# EAGLE design LightBar (EAGLE 7.3.0)
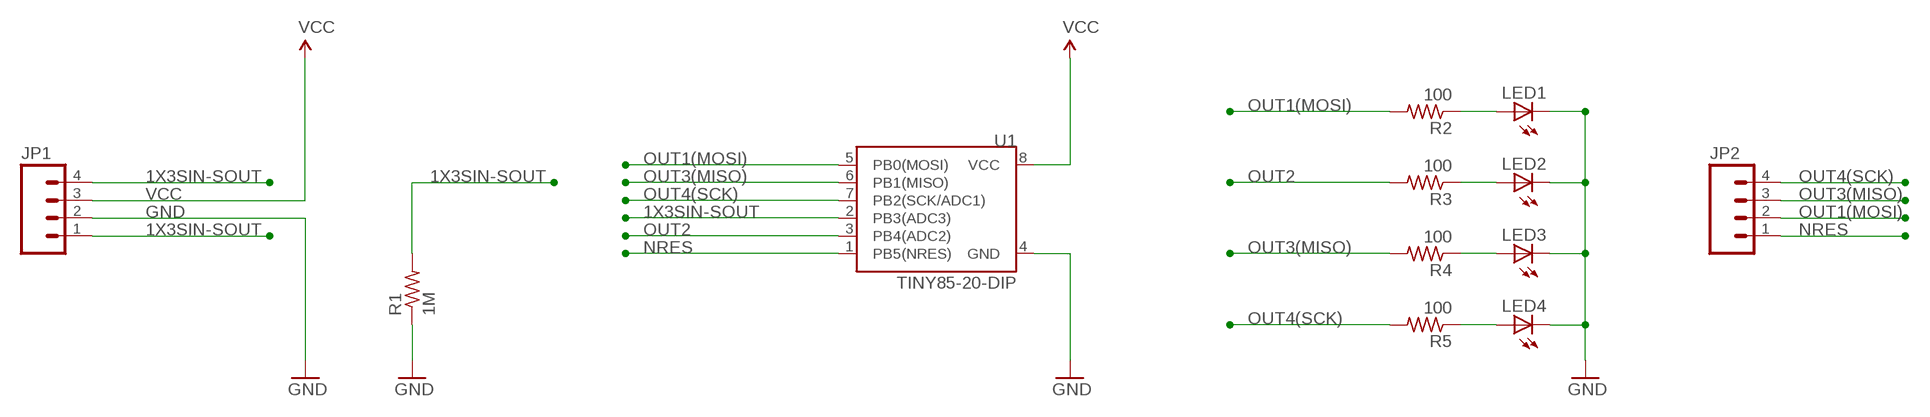
[diagram p0: schematic, sheet 1]

## Parts
JP1  M04PTH  [1X04]
JP2  M04PTH  [1X04]
LED1  LEDSQR2X5  [LED2X5]
LED2  LEDSQR2X5  [LED2X5]
LED3  LEDSQR2X5  [LED2X5]
LED4  LEDSQR2X5  [LED2X5]
R1  1M  R-US_R0603  [R0603]
R2  100  R-US_R0603  [R0603]
R3  100  R-US_R0603  [R0603]
R4  100  R-US_R0603  [R0603]
R5  100  R-US_R0603  [R0603]
U1  TINY85-20-DIP  ATTINY45TINY85-20-DIP  [DIP08]

## Nets
1X3SIN-SOUT: JP1.1 JP1.4 R1.2 U1.2(PB3(ADC3))
GND: JP1.2 LED1.K(C) LED2.K(C) LED3.K(C) LED4.K(C) R1.1 U1.4(GND)
N$1: LED1.A R2.1
N$2: LED2.A R3.1
N$3: LED3.A R4.1
N$4: LED4.A R5.1
NRES: JP2.1 U1.1(PB5(NRES))
OUT1(MOSI): JP2.2 R2.2 U1.5(PB0(MOSI))
OUT2: R3.2 U1.3(PB4(ADC2))
OUT3(MISO): JP2.3 R4.2 U1.6(PB1(MISO))
OUT4(SCK): JP2.4 R5.2 U1.7(PB2(SCK/ADC1))
VCC: JP1.3 U1.8(VCC)

## Library data of the parts
JP1 JP2 = SparkFun-Connectors:M04: Header 4 Standard 4-pin 0.1" header. Use with straight break away headers (SKU : PRT-00116), right angle break away headers (PRT-00553), swiss pins (PRT-00743), machine pins (PRT-00117), and female headers (PRT-00115). Molex polarized connector foot print use with SKU : PRT-08231 with associated crimp pins and housings. 1MM SMD Version SKU: PRT-10208
LED1-LED4 = adafruit:LED: LED OSRAM: - CHIPLED LG R971, LG N971, LY N971, LG Q971, LY Q971, LO R971, LY R971 LH N974, LH R974 LS Q976, LO Q976, LY Q976 LO Q996 - Hyper CHIPLED LW Q18S LB Q993, LB Q99A, LB R99A - SideLED LS A670, LO A670, LY A670, LG A670, LP A670 LB A673, LV A673, LT A673, LW A673 LH A674 LY A675 LS A676, LA A676, LO A676, LY A676, LW A676 LS A679, LY A679, LG A679 - Hyper Micro SIDELED® LS Y876, LA Y876, LO Y876, LY Y876 LT Y87S - SmartLED LW L88C, LW L88S LB L89C, LB L89S, LG L890 LS L89K, LO L89K, LY L89K LS L896, LA L896, LO L896, LY L896 - TOPLED LS T670, LO T670, LY T670, LG T670, LP T670 LSG T670, LSP T670, LSY T670, LOP T670, LYG T670 LG T671, LOG T671, LSG T671 LB T673, LV T673, LT T673, LW T673 LH T674 LS T676, LA T676, LO T676, LY T676, LB T676, LH T676, LSB T676, LW T676 LB T67C, LV T67C, LT T67C, LS T67K, LO T67K, LY T67K, LW E67C LS E67B, LA E67B, LO E67B, LY E67B, LB E67C, LV E67C, LT E67C LW T67C LS T679, LY T679, LG T679 LS T770, LO T770, LY T770, LG T770, LP T770 LB T773, LV T773, LT T773, LW T773 LH T774 LS E675, LA E675, LY E675, LS T675 LS T776, LA T776, LO T776, LY T776, LB T776 LHGB T686 LT T68C, LB T68C - Hyper Mini TOPLED® LB M676 - Mini TOPLED Santana® LG M470 LS M47K, LO M47K, LY M47K Source: http://www.osram.convergy.de/
R1-R5 = adafruit:R-US_: RESISTOR, American symbol
U1 = SparkFun-DigitalIC:ATTINY45: Atmel 8-pin 2/4/8kB flash uC; PROD_ID: IC-09445

## Board
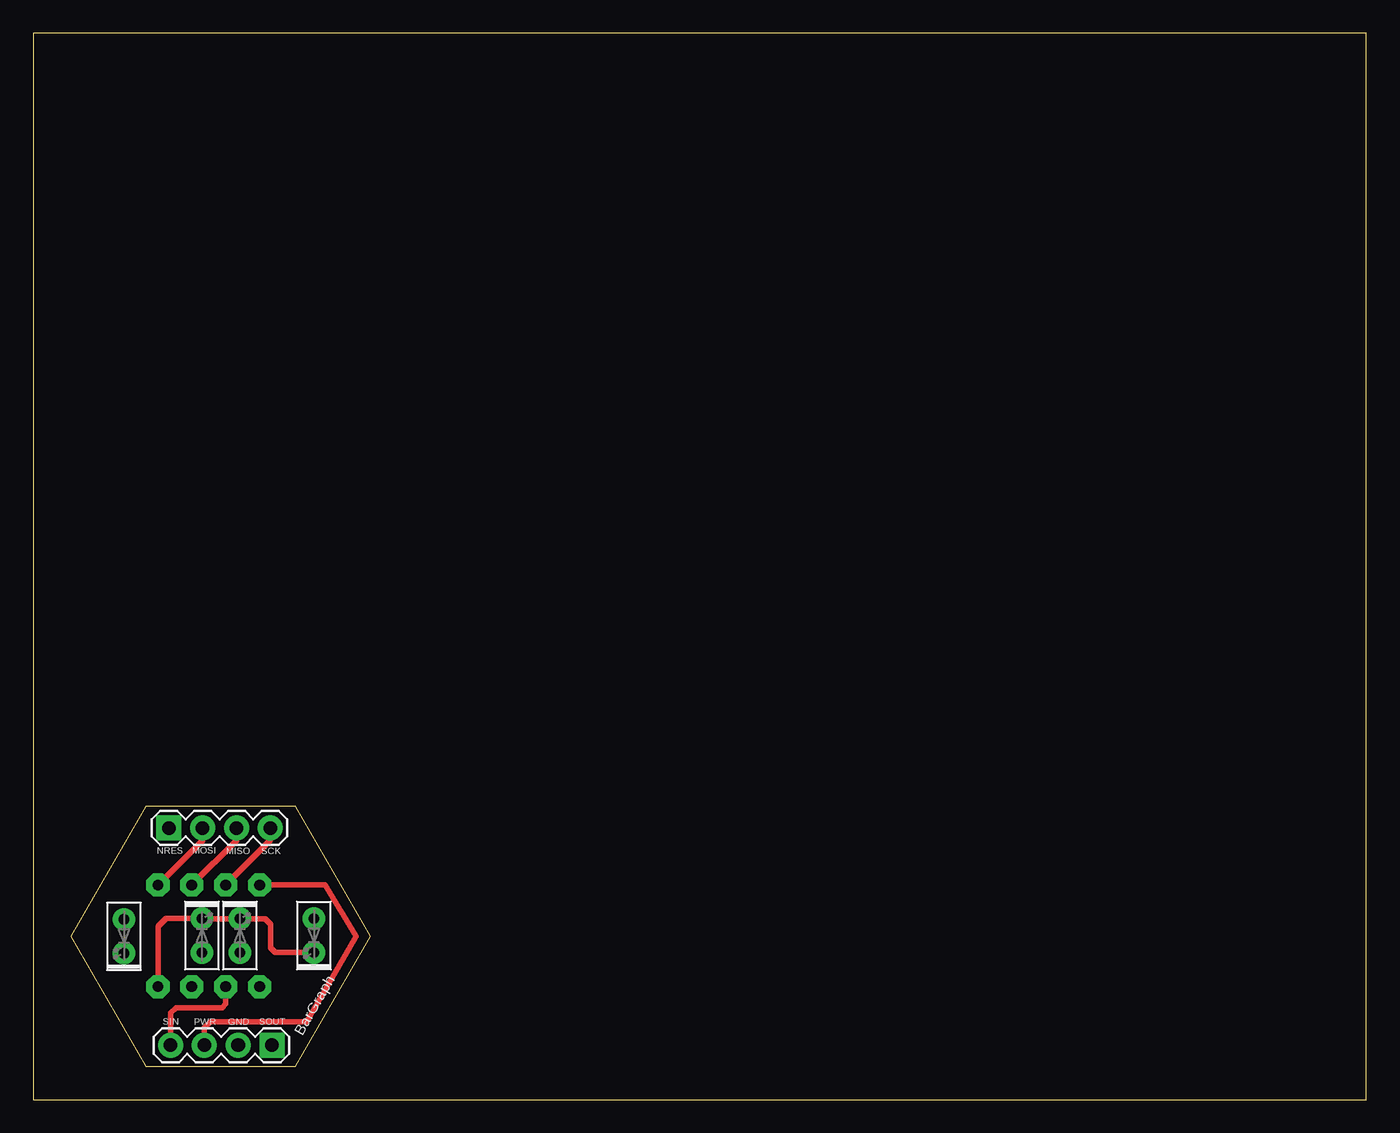
[diagram p1: board, top side]
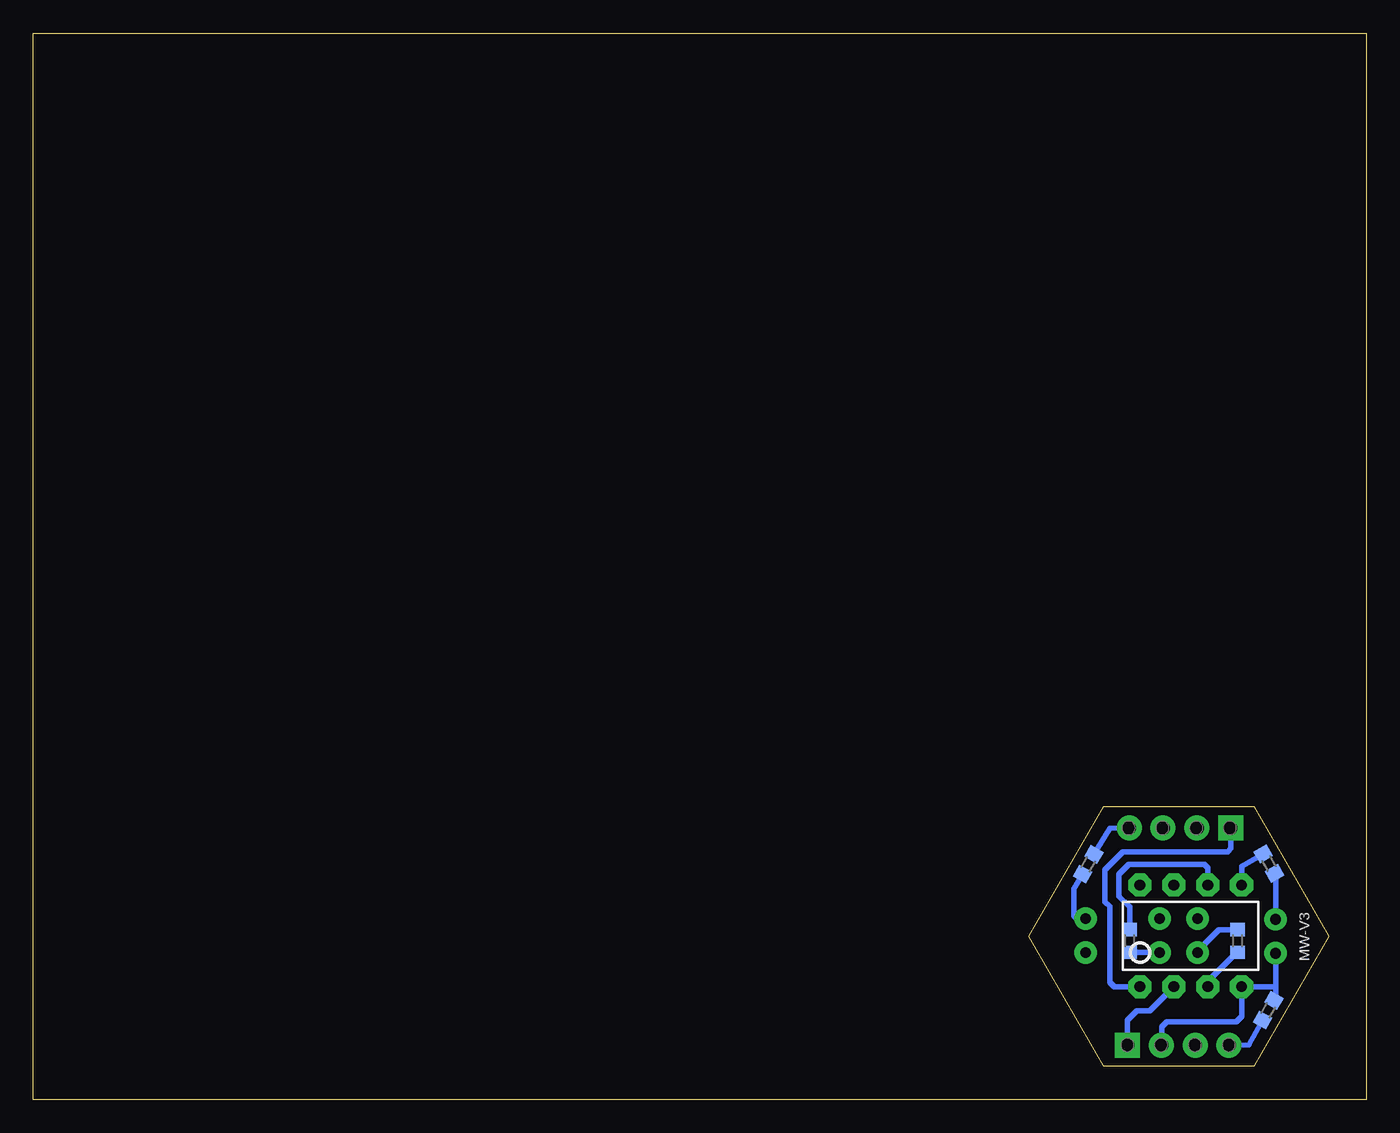
[diagram p2: board, bottom side, seen from below]

Size 100 x 80 mm. Coordinates in mm from the lower left corner, seen from the top.
Outline: 0,0 100,0 100,80 0,80 0,0
Outline: 8.45,2.5 19.7,2.5 25.32,12.24 19.7,21.98 8.45,21.98 2.82,12.24 8.45,2.5
Copper layers (1*16): Top 0.035mm / dielectric 1.5mm / Bottom 0.035mm
Design rules "default *": minimum track width 10mil, minimum drill 24mil, track to track 8mil, track to pad 8mil, pad to pad 8mil, via to via 8mil, smd to smd 8mil, copper to edge 0mil, drill to drill 8mil, minimum pad ring 10mil, minimum via ring 8mil, stop-mask expansion 4mil, vias tented up to drill 0mil, thermal gap 10mil

### Footprints (pad centres in the part's own frame; a part is rotated, then mirrored left to right if it is on the bottom)
1X04 = drill 1.016 pad 1.88 square: 1 0,0 | drill 1.016 pad 1.88: 2 2.54,0; 3 5.08,0; 4 7.62,0
LED2X5 = drill 0.813 pad 1.676: A -1.27,0; K 1.27,0
R0603 = smd 1 x 1.1: 1 -0.85,0; 2 0.85,0
DIP08 = drill 0.813 pad 1.727 octagon: 1 -3.81,-3.81; 2 -1.27,-3.81; 3 1.27,-3.81; 4 3.81,-3.81; 5 3.81,3.81; 6 1.27,3.81; 7 -1.27,3.81; 8 -3.81,3.81

### Placement (x,y rotation side)
JP1  17.91,4.08 180 top
JP2  10.16,20.37 0 top
LED1  6.8,12.25 270 top
LED2  12.65,12.3 90 top
LED3  15.5,12.3 90 top
LED4  21.05,12.3 270 top
R1  7.35,6.7 240 bottom
R2  7.3,17.7 120 bottom
R3  9.65,11.9 270 bottom
R4  17.75,11.9 90 bottom
R5  20.85,17.65 60 bottom
U1  13.16,12.28 0 bottom

### Tracks (layer width: path | path; a pad name or v marks a point on that pad's centre or on a via)
1X3SIN-SOUT
  Top 0.4: U1.2 14.43,7.18 14.15,6.9 10.7,6.9 10.3,6.5 JP1.4
  Bottom 0.4: R1.2 8.8,4.1 JP1.4 | JP1.1 17.91,5.94 17.2,6.65 16.25,6.65 U1.2
GND
  Top 0.4: U1.4 9.35,13 9.95,13.6 12.62,13.6 LED2.K LED3.K 17.38,13.57 17.8,13.15 17.8,11.4 18.15,11.05 21.03,11.05 LED4.K
  Bottom 0.4: LED1.K 6.8,8.4 | 6.8,8.4 6.8,7.56 R1.1 | 6.8,8.4 6.87,8.47 U1.4 9.35,6.25 9.75,5.85 14.95,5.85 15.35,5.45 15.35,4.1 JP1.2
N$1
  Bottom 0.4: R2.1 6.8,16.89 LED1.A
N$2
  Bottom 0.4: LED2.A 12.65,11.15 11.05,12.75 R3.1
N$3
  Bottom 0.4: R4.1 15.52,11.05 LED3.A
N$4
  Bottom 0.4: R5.1 21.95,15.8 21.95,13.8 21.7,13.55 21.07,13.55 LED4.A
NRES
  Bottom 0.4: JP2.1 10.16,18.84 10.4,18.6 18.25,18.6 19.6,17.25 19.6,14.85 19.25,14.5 19.25,8.8 18.9,8.45 16.99,8.45 U1.1
OUT1(MOSI)
  Top 0.4: JP2.2 12.7,19.44 U1.5
  Bottom 0.4: U1.5 9.35,17.5 R2.2
OUT2
  Bottom 0.4: U1.3 11.89,8.86 10.05,10.7 10,10.7 R3.2
OUT3(MISO)
  Top 0.4: JP2.3 15.24,19.44 U1.6
  Bottom 0.4: U1.6 11.89,17.39 12.15,17.65 17.8,17.65 18.55,16.9 18.55,15.25 17.75,14.45 R4.2
OUT4(SCK)
  Top 0.4: JP2.4 17.78,19.44 U1.7
  Bottom 0.4: R5.2 19.25,20.35 JP2.4
VCC
  Top 0.4: JP1.3 12.83,5.38 13.3,5.85 20.5,5.85 24.2,12.25 21.9,16.1 U1.8

### Text on the board
tPlace: NRES | MOSI | MISO | SCK | SIN | PWR | GND | SOUT | BarGraph
bPlace: MW-V3